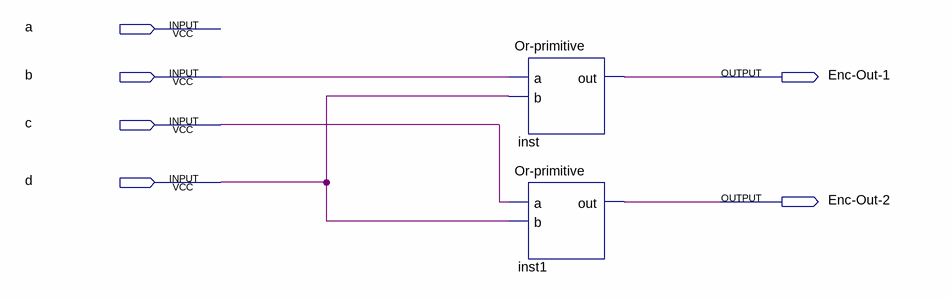
[diagram p0: schematic sheet]
// Quartus schematic 4To2Encoder.bdf as structural Verilog: 2 symbols, 6 pins
module \4To2Encoder  (
  input  a,
  input  b,
  input  c,
  input  d,
  output \Enc-Out-1 ,
  output \Enc-Out-2 
);

  \Or-primitive  inst (.a(b), .b(d), .out(\Enc-Out-1 ));
  \Or-primitive  inst1 (.a(c), .b(d), .out(\Enc-Out-2 ));
endmodule
